# Altium schematic sheet CPU.SchDoc
size A4; SheetNumber: 4; SheetTotal: 4
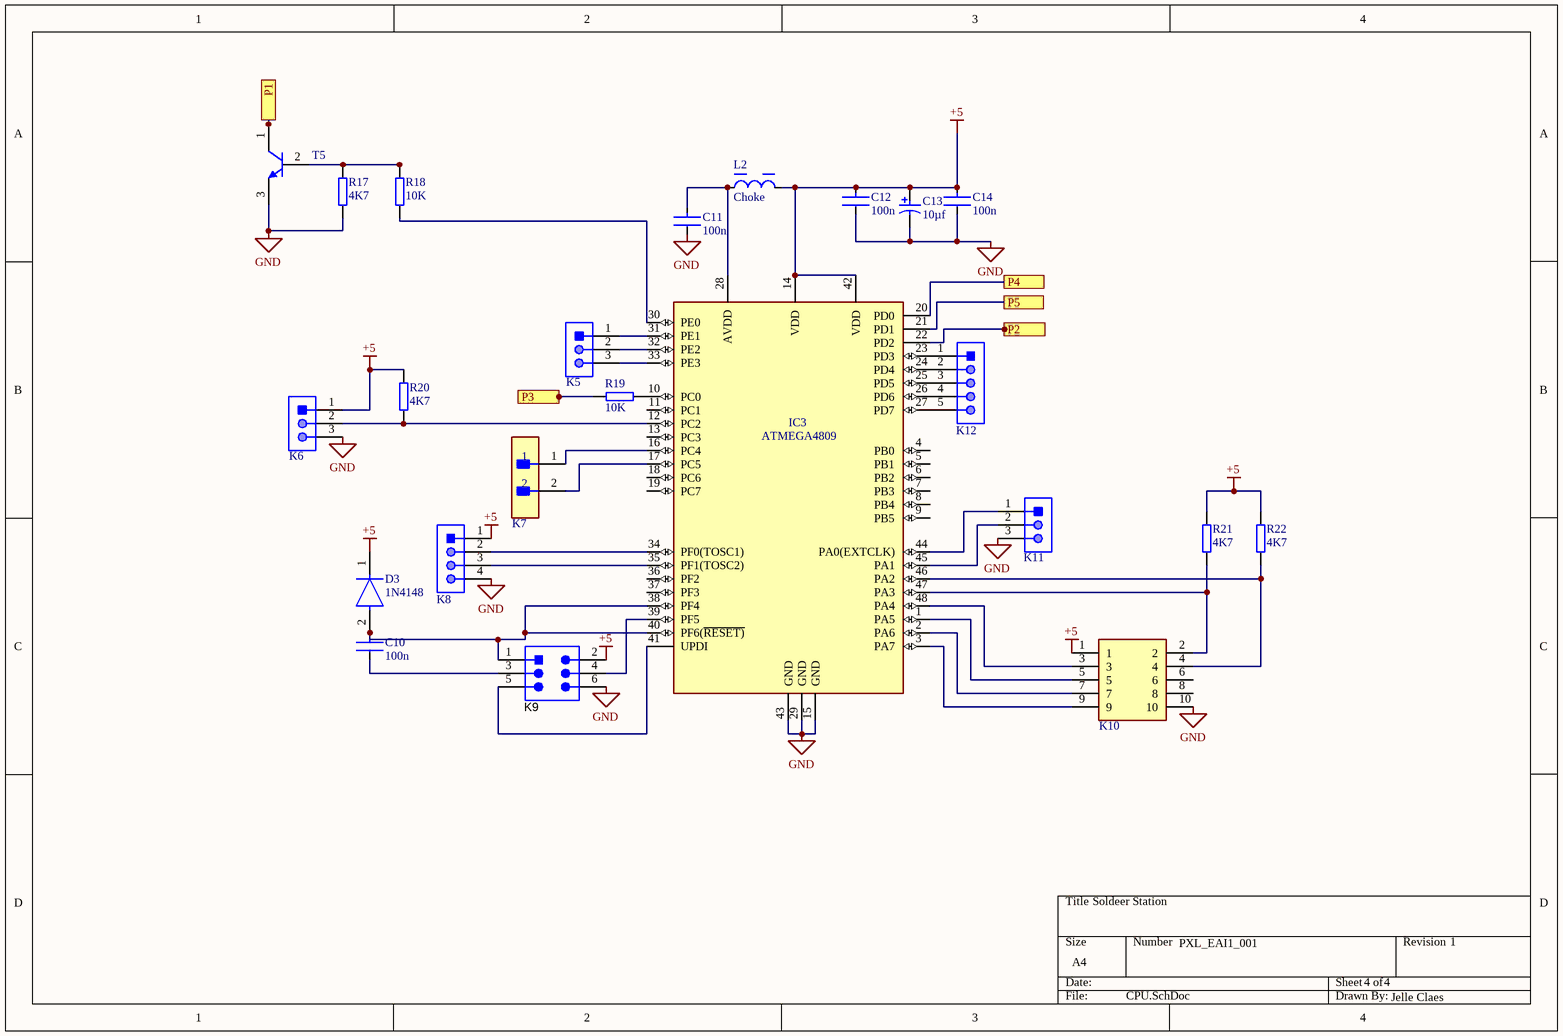
[diagram p0: CPU.SchDoc]

## Parts
C10  100n  [CC_0805_m]
C11  100n  [CC_0805_m]
C12  100n  [CC_0805_L]
C13  10µf  [D4L5.4]
C14  100n  [CC_0805_L]
D3  1N4148  [SOD-123FL]
IC3  ATMEGA4809  [TQFP_48_M]
K5  22-28-4033  [MOLX-22-28-4033_V]  (value not drawn)
K6  22-28-4033  [MOLX-22-28-4033_V]  (value not drawn)
K7  M22-2510205  [FP-M22-2510205-MFG]  (value not drawn)
K8  61300411121  [61300411121]  (value not drawn)
K9  TSW-103-07-G-D  [SMTC-TSW-103-07-G-D_V]  (value not drawn)
K10  5x2 box pinheader  [2x5 box pinheader]  (value not drawn)
K11  22-28-4033  [MOLX-22-28-4033_V]  (value not drawn)
K12  61300511121  [61300511121]  (value not drawn)
L2  Choke  [CC_0805_L]
R17  4K7  [R_0805_M]
R18  10K  [R_0805_M]
R19  10K  [R_0805_M]
R20  4K7  [R_0805_M]
R21  4K7  [R_0805_M]
R22  4K7  [R_0805_M]
T5  Transistor_NPN  [SOT_23]  (value not drawn)

## Ports
P1 (see voeding[1C]), P2 (see voeding[2B]), P3 (see PWM[1C]), P4 (see thermokoppel[2B]), P5 (see thermokoppel[2C])

## Nets
+5: C12.1 C13.2 C14.1 D3.1(C) IC3.14(VDD) IC3.42(VDD) K6.1 K8.1 K9.2 K10.1 L2.2 R20.2 R21.2 R22.2
GND: C11.2 C12.2 C13.1 C14.2 IC3.15(GND) IC3.29(GND) IC3.43(GND) K6.3 K8.4 K9.6 K10.10 K11.3 R17.1 T5.3(E)
P1: T5.1(C) ; port P1
P2: IC3.22(PD2) ; port P2
P3: R19.1 ; port P3
P4: IC3.20(PD0) ; port P4
P5: IC3.21(PD1) ; port P5
NetC10_1: C10.1 D3.2(A) IC3.38(PF4) IC3.40(PF6(~{RESET)}) K9.1
NetC10_2: C10.2 K9.3
NetC11_1: C11.1 IC3.28(AVDD) L2.1
NetIC3_1: IC3.1(PA5) K10.5
NetIC3_2: IC3.2(PA6) K10.7
NetIC3_3: IC3.3(PA7) K10.9
NetIC3_10: IC3.10(PC0) R19.2
NetIC3_12: IC3.12(PC2) K6.2 R20.1
NetIC3_16: IC3.16(PC4) K7.1
NetIC3_17: IC3.17(PC5) K7.2
NetIC3_23: IC3.23(PD3) K12.1
NetIC3_24: IC3.24(PD4) K12.2
NetIC3_25: IC3.25(PD5) K12.3
NetIC3_26: IC3.26(PD6) K12.4
NetIC3_27: IC3.27(PD7) K12.5
NetIC3_30: IC3.30(PE0) R18.1
NetIC3_31: IC3.31(PE1) K5.1
NetIC3_32: IC3.32(PE2) K5.2
NetIC3_33: IC3.33(PE3) K5.3
NetIC3_34: IC3.34(PF0(TOSC1)) K8.2
NetIC3_35: IC3.35(PF1(TOSC2)) K8.3
NetIC3_39: IC3.39(PF5) K9.4
NetIC3_41: IC3.41(UPDI) K9.5
NetIC3_44: IC3.44(PA0(EXTCLK)) K11.1
NetIC3_45: IC3.45(PA1) K11.2
NetIC3_46: IC3.46(PA2) K10.4 R22.1
NetIC3_47: IC3.47(PA3) K10.2 R21.1
NetIC3_48: IC3.48(PA4) K10.3
NetR17_2: R17.2 R18.2 T5.2(B)

Not connected (* = marked no-connect by the designer): IC3 4(PB0) 5(PB1) 6(PB2) 7(PB3) 8(PB4) 9(PB5) 11(PC1) 13(PC3) 18(PC6) 19(PC7) 36(PF2) 37(PF3); K10 6 8

## Notes on the sheet
- Soldeer Station
- PXL_EAI1_001
- 4
- 1
- Jelle Claes

## Library data of the parts
C10-C12 C14 = Capacitor_Ceramic: Manufacturer: KEMET; Manufacturer Part Number: C0805C224K5RACTU; Value: 0.22 μF; Temperature Characteristic: X7R; Temperature Coefficient: 30ppm/°C; Tolerance: 0.1; Voltage Rating: 50 V; ComponentLink2URL: https://content.kemet.com/datasheets/KEM_C1003_C0G_SMD.pdf; Device Class L3: Ceramic Capacitors; Lead Free: Yes; Temperature: -55°C to +125°C; RoHS: TRUE; Capacitance: 0.22 μF; Automotive: No; Material: Ceramic; Octopart: https://octopart.com/c0805c224k5ractu-kemet-144670; Temperature Range Low: -55°C; Height: 0.88mm; Device Class L1: Passive Components; Digikey Description: CAP CER 0.22UF 50V X7R 0805; ComponentLink2Description: Datasheet; Mouser Description: CAP CER 0.22UF 50V X7R 0805; Category: Cap; Ipc Land Pattern Name: CAPC200125X78; Temperature Range High: +125°C; Package: C0805C-DN; Device Class L2: Capacitors
C13 = Capacitor_Electrolytic: Manufacturer: Panasonic; Voltage Rating: 25 V; ComponentLink2URL: http://industrial.panasonic.com/cdbs/www-data/pdf/RDE0000/ABA0000C1181.pdf; Height: 10.2 mm; Max Operating Temperature: 105 degC; PackageReference: EEE-FK1E221P; ComponentLink1Description: Manufacturer URL; ComponentLink1URL: http://www.panasonic.com/; Mount: Surface Mount; REACH SVHC: No SVHC; Min Operating Temperature: -55 degC; ComponentLink2Description: Datasheet; DatasheetVersion: 03/2016; Length: 10.2 mm; RoHSCompliant: true; Packaging: Tape and Reel; Package Quantity: 500; Lead Pitch: 3.1 mm; Pins: 2; PackageDescription: 2-Pin Electrolytic Aluminum Capacitor, Body 8.3 x 8.3 mm; Mounting Technology: Surface Mount
D3 = Diode: Manufacturer Part Number: 1N4007; Manufacturer: Diotec; Max Surge Forward Current: 27A; Forward Current: 1A; Max Junction Temp: +175°C; Reverse Voltage: 1000V; Value: 15pF; Peak Reverse Current: 5uA; Category: Diode; Temperature Range Low: -50°C; Automotive: No; Temperature: -50°C to +175°C; Lead Free: Yes; ComponentLink2Description: Datasheet; Max Repetitive Reverse Voltage: 1000V; ComponentLink2URL: https://datasheet.octopart.com/1N4007-Diotec-datasheet-62346875.pdf; Device Class L3: Rectifier Diodes; Height: 2.8mm; Octopart: https://octopart.com/1n4007-diotec-4040411; Package: 1N4007; Temperature Range High: +175°C; Device Class L1: Discrete Semiconductors; Device Class L2: Diodes; RoHS: TRUE; Capacitance: 15pF; Ipc Land Pattern Name: DIOAD888W100L520D280
IC3 = ATMEGA4809: Peripherals: Brown-out Detect/Reset; Number of I/Os: 41; Core Architecture: AVR; Memory Size: 48KB; Interface: I2C; Oscillator Type: Internal; Memory Type: FLASH; Series: megaAVR® 0, Functional Safety (FuSa); Min Operating Temperature: -40°C; Mount: Surface Mount; Case/Package: TQFP; RoHS Compliant: Yes; Max Operating Temperature: 85°C
K5 K6 K11 = CMP-1676-00001-5: Male Header, Pitch 2.54 mm, 1 x 3 Position, Height 8.38 mm, Tail Length 3.18 mm, RoHS, Bulk; Manufacturer: Molex; Rows: 1; Voltage Rating: 250 V; Current Rating: 4 A; Min Operating Temperature: 0 degC; Lead Pitch: 0.1 inch; Packaging: Bulk; Contact Finish: Gold; RoHSCompliant: true; Contact Material: Brass; PackageReference: 22-28-4033; REACH SVHC: Unknown; PackageDescription: Male Header, Pitch 2.54 mm, 1 x 3 Position, Height 8.38 mm, Tail Length 3.18 mm; ComponentLink2URL: http://www.molex.com/pdm_docs/sd/022284033_sd.pdf; Height: 8.38 mm; Mounting Technology: Through Hole; ComponentLink1Description: Manufacturer URL; Length: 7.62 mm; Mount: Through Hole; DatasheetVersion: Rev. G, 01/2012; Max Operating Temperature: 75 degC; ComponentLink2Description: Datasheet; Colour: Black; Pins: 3; Contact Plating: Gold; Package Quantity: 1; ComponentLink1URL: http://www.molex.com/
K7 = CMP-15831-000005-1: CONN HEADER VERT 2POS 2MM; Manufacturer: Harwin; Conn Gender: Male; Current Rating: 2A; Number Of Contacts: 2; Conn Orientation: Vertical; Temperature Range Low: -40°C; Device Class L1: Connectors; ComponentLink2URL: https://cdn.harwin.com/pdfs/C018XX_M22_Series_Connectors.pdf; Temperature Range High: +105°C; Pitch: 2mm; Number Of Rows: 1; Temperature: -40°C to +105°C; Automotive: No; Device Class L3: unset; Octopart: https://octopart.com/m22-2510205-harwin-2538221; Mouser Description: Headers & Wire Housings 2 PIN SIL VERTICAL GOLD PIN HEADER; Height: 5.45mm; Category: Conn; Digikey Description: CONN HEADER VERT 2POS 2MM; Contact Material: Gold,Nickel; Lead Free: Yes; ComponentLink2Description: Datasheet; Manufacturer Part Number: M22-2510205; Device Class L2: Headers and Wire Housings; Package: 0; Footprint Url: https://cdn.harwin.com/pdfs/M22-251.pdf; RoHS: TRUE
K8 = CMP-1502-01064-1: THT Vertical Pin Header WR-PHD, Pitch 2.54 mm, Single Row, 4 pins; Manufacturer: Wurth Elektronik; Withstanding Voltage: 500VAC; Rated Current: 3A; Working Voltage: 250VAC; Pin Number: 4; Gender: Male; Contact Resistance: 20mOhm; Pitch: 2.54mm; Manufacturer URL: http://www.we-online.de; Operating Temperature: -40to105degC; Packaging: Bag; Mounting Technology: THT; Package Reference: 61300411121; Datasheet URL: https://katalog.we-online.de/em/datasheet/6130xx11121.pdf; Publisher: WurthElektronik; Part Number: 61300411121; Row Number: Single; Orientation: Vertical
K9 = CMP-2000-07329-1: Through Hole Header, Pitch 2.54 mm, 2 x 3 Position, Height 8.58 mm, Tail Length 2.54 mm, -55 to 125 degC, RoHS, Bulk; Manufacturer: Samtec-Inc.; Number of Positions Loaded: All; Number of Positions: 6; Row Spacing: 0.100"(2.54mm); Connector Type: Header,Unshrouded; Package Reference: TSW-103-07-G-D; Termination: Solder; Manufacturer URL: http://www.samtec.com/; Contact Finish: Gold; Contact Mating Length: 0.230"(5.84mm); Package Description: Through Hole Header, Pitch 2.54 mm, 2 x 3 Position, Height 8.58 mm, Tail Length 2.54 mm; Datasheet Version: 12/2015; Number of Rows: 2; Features: -; Family: RectangularConnectors-Headers,MalePins; Fastening Type: -; Datasheet URL: http://suddendocs.samtec.com/catalog_english/tsw_th.pdf; Category: Connectors,Interconnects; Package URL: http://suddendocs.samtec.com/prints/tsw-xxx-xx-xxx-x-xx-xxx-mkt.pdf; Mounting Type: ThroughHole; Contact Finish Thickness: 10µin(0.25µm); Packaging: Bulk; Color: Black; Pitch: 0.100"(2.54mm); Series: TSW; Contact Type: MalePin; Mounting Technology: ThroughHole
K10 = 5x2 box pinheader: Connector; Manufacturer_Name: Amphenol; Manufacturer_Part_Number: T821110A1S100CEU; Datasheet Link: https://docs.rs-online.com/e09c/0900766b81359cba.pdf; Height: 9.15mm; Mouser Part Number: N/A; Mouser Price/Stock: https://www.mouser.co.uk/ProductDetail/Amphenol/T821110A1S100CEU?qs=3IN%252Br8p6BrNf%2FuKCWm44Bg%3D%3D; Arrow Part Number: T821110A1S100CEU; Arrow Price/Stock: https://www.arrow.com/en/products/t821110a1s100ceu/amphenol-fci?region=europe
K12 = 5pin: THT Vertical Pin Header WR-PHD, Pitch 2.54 mm, Single Row, 5 pins; Manufacturer: Wurth Elektronik; Pin Number: 5; Contact Resistance: 20mOhm; Working Voltage: 250VAC; Pitch: 2.54mm; Withstanding Voltage: 500VAC; Rated Current: 3A; Gender: Male; Datasheet URL: https://katalog.we-online.de/em/datasheet/6130xx11121.pdf; Orientation: Vertical; Mounting Technology: THT; Row Number: Single; Package Reference: 61300511121; Publisher: WurthElektronik; Part Number: 61300511121; Packaging: Bag; Manufacturer URL: http://www.we-online.de; Operating Temperature: -40to105degC
L2 = Choke: Tolerance: 20%; Shielding: Shielded; Saturation Current: 10A; Test Frequency: 100kHz; RMS Current (Irms): 8.5A; Inductance: 10uH; Series Resistance: 14.1R; DC Resistance (DCR): 14.1mR; Self Resonant Frequency: 18MHz; Ratings: AEC-Q200; Width: 12.8mm; Series: WE-HCI; Length: 0.512inch; Mount: Surface Mount; Resistor Type: Wirewound; RoHS Compliant: Yes; Package Quantity: 1; Min Operating Temperature: -40°C; Inductance Tolerance: 20%; Termination: SMD/SMT; Max DC Current: 8.5A; Height - Seated (Max): 0.197inch; Case/Package: 1350; Current Rating: 8.5A; Max Operating Temperature: 155°C; Packaging: Tape and Reel; Height: 4.7mm
R17-R22 = Resistor: Manufacturer: Vishay Dale; Part Number: CRCW08050000Z0EA
T5 = Transistor_NPN: Manufacturer: On Semiconductor; PartNumber: BC547C; IC Continuous (A): 0.1; fT Min (MHz): 150; Packing: Bulk Box; Polarity: NPN; Mounting Technology: Through Hole; ComponentLink1URL: http://www.onsemi.com/; ComponentLink1Description: Manufacturer URL; ComponentLink3URL: http://www.onsemi.cn/pub_link/Collateral/2N6426-D.PDF; DatasheetVersion: Rev. 7; PackageVersion: Rev. AM; RoHS: FALSE; ComponentLink2URL: http://www.onsemi.com/pub_link/Collateral/BC546-D.PDF; ComponentLink3Description: Package Specification; PackageDescription: 3-Pin Transistor Outline, Body 4.825 x 3.685 mm, Pitch 1.27 mm; PackageReference: TO-92-3-29-11_AM_SL; ComponentLink2Description: Datasheet